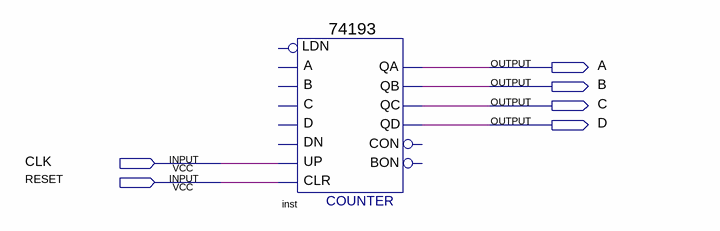
[diagram p0: schematic sheet]
// Quartus schematic practica1.bdf as structural Verilog: 1 symbols, 6 pins
module practica1 (
  input  CLK,
  input  RESET,
  output A,
  output B,
  output C,
  output D
);

  \74193  inst (.CLR(RESET), .UP(CLK), .QB(B), .QA(A), .QD(D), .QC(C));  // open: D, C, B, A, DN, LDN, CON, BON
endmodule
